# EasyEDA Pro project card-issuance.eprj, schematic Schematic1
Board Name: Power; Create Date: 2026-02-10; Page Name: P1; Project Name: card-issuance; Schematic Name: Schematic1; Update Date: 2026-02-17; Company: EasyEDA.com; Page Size: A4; Version: V1.0
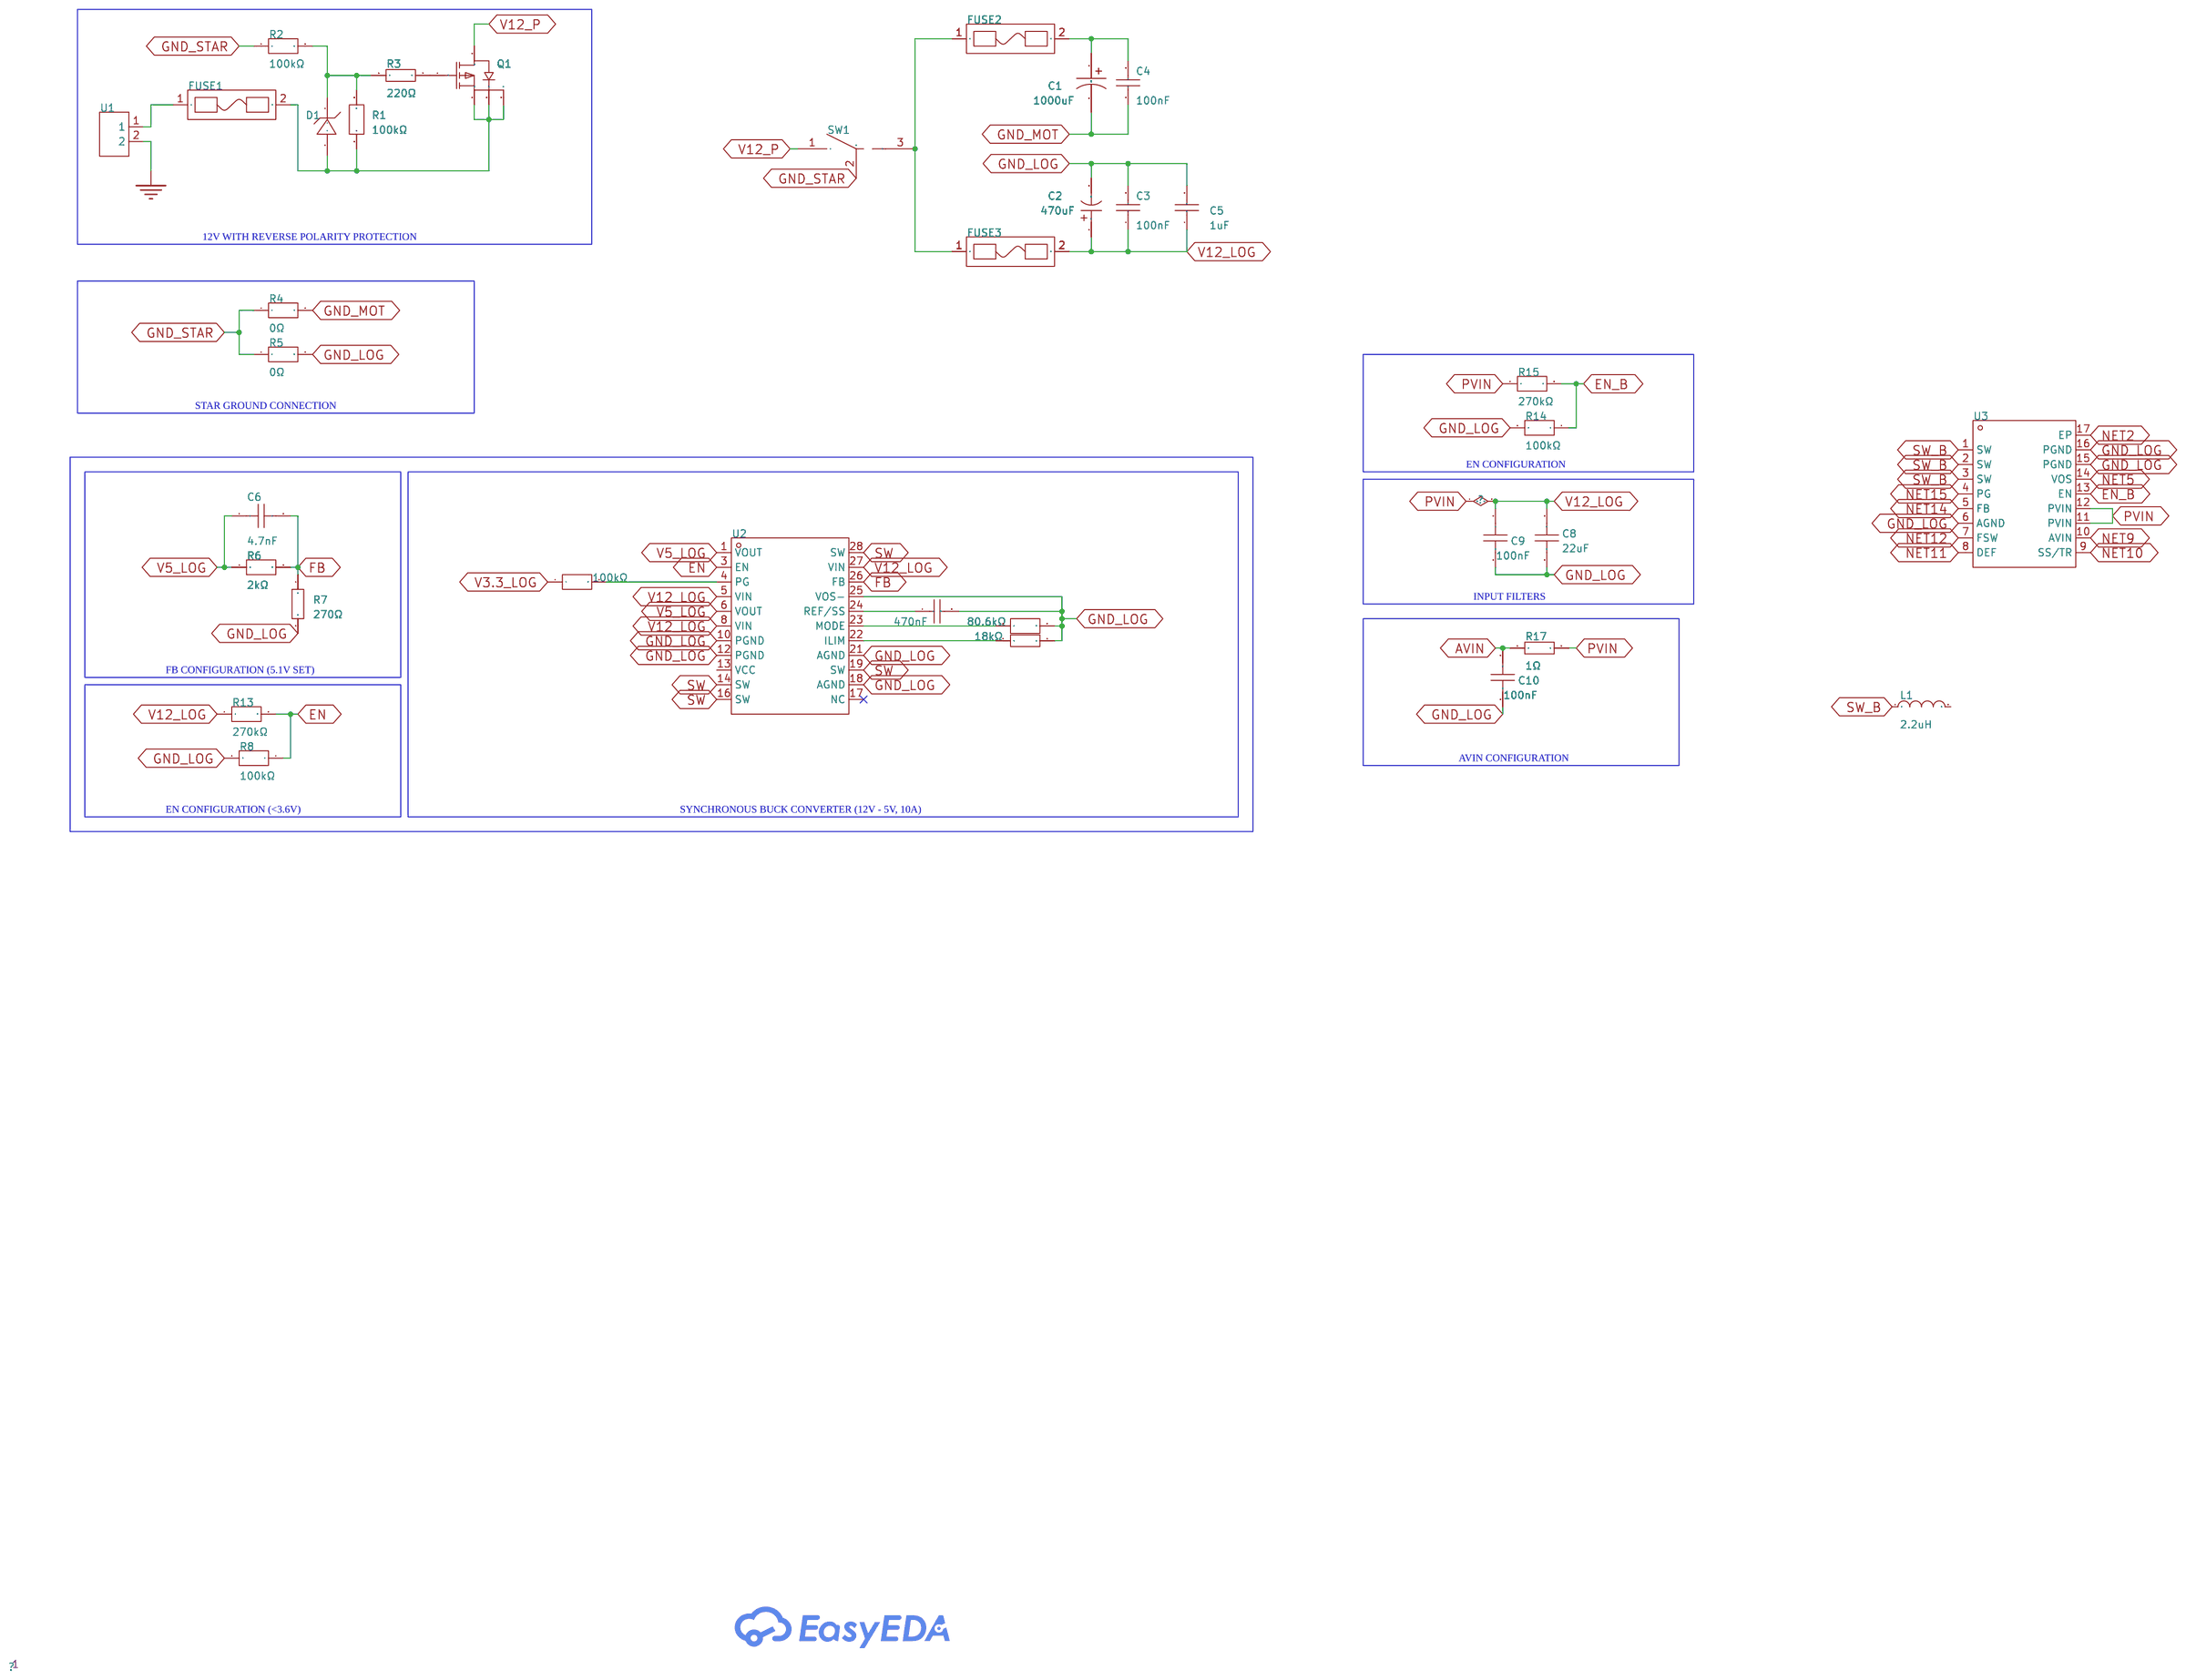
[diagram p0: schematic sheet]

## Parts
C1  1000uF  [CAP-TH_BD10.0-P5.00-D1.0-FD]
C2  470uF  [CAP-TH_BD8.0-P3.50-D0.6-FD]
C3  100nF  [C0402]
C4  100nF  [C0402]
C5  1uF  [C0603]
C6  4.7nF  [CAP-TH_L9.0-W3.5-P7.50-D0.6]
C7  470nF  [C0603]
C8  22uF  [C0805]
C9  100nF  [C0805]
C10  100nF  [C0805]
D1  SMAZ15-13-F  [SMA_L4.3-W2.6-LS5.2-RD]
FUSE1  XF-508P-A-B  [FUSE-TH_XF-508P-A-B]
FUSE2  XF-508P-A-B  [FUSE-TH_XF-508P-A-B]
FUSE3  XF-508P-A-B  [FUSE-TH_XF-508P-A-B]
L1  2.2uH  [IND-SMD_L4.0-W4.0_0.47UH04209.5A]
Q1  HD504P190S  [TDSON-8_L5.9-W5.2-P1.27-BL]
R1  100kΩ  [RES-TH_BD4.5-L11.5-P15.50-D0.8]
R2  100kΩ  [RES-TH_BD4.5-L11.5-P15.50-D0.8]
R3  220Ω  [RES-TH_BD3.3-L9.0-P13.00-D0.6]
R4  0Ω  [RES-TH_BD2.5-L6.5-P10.50-D0.6]
R5  0Ω  [RES-TH_BD2.5-L6.5-P10.50-D0.6]
R6  2kΩ  [RES-TH_BD2.3-L6.5-P10.50-D0.5]
R7  270Ω  [RES-TH_BD2.2-L6.5-P10.50-D0.6]
R8  100kΩ  [RES-TH_BD4.5-L11.5-P15.50-D0.8]
R10  100kΩ  [RES-TH_BD4.5-L11.5-P15.50-D0.8]
R11  18kΩ  [RES-TH_BD2.3-L6.5-P10.50-D0.5]
R12  80.6kΩ  [RES-TH_BD2.5-L6.5-P10.50-D0.6]
R13  270kΩ  [RES-TH_BD2.2-L6.5-P10.50-D0.6]
R14  100kΩ  [RES-TH_BD4.5-L11.5-P15.50-D0.8]
R15  270kΩ  [RES-TH_BD2.2-L6.5-P10.50-D0.6]
R17  1Ω  [RES-TH_BD2.2-L6.5-P10.50-D0.6]
SW1  SS31-BBOWQ-RS20-R  [SW-TH_SS31-BBNNQ-RS30-R]
U1  DB135-10.16-2P-GN-P  [CONN-TH_DG135T-10.16-02P-14-00A]
U2  M1210DQEE  [QFN-28_L7.0-W7.0_M1210DQEE]
U3  TPS62133RGTR  [VQFN-16_L3.0-W3.0-P0.50-TL-EP]

## Library data of the parts
C1 = 01EC4294SHC1000UF25V: LCSC Part Name: 1000uF ±20% 25V; Supplier Part: C503217; Manufacturer: KNSCHA(科尼盛); Supplier Footprint: 插件,D10xL16mm; JLCPCB Part Class: Extended Part; Datasheet: https://item.szlcsc.com/datasheet/01EC4294SHC1000UF25V/515630.html; Supplier: LCSC; Tolerance: ±20%; Voltage Rating: 25V; Ripple Current: 610mA@120Hz; Pin Spacing: 5mm; Diameter: 10mm; Height - Seated (Max): 16mm; Lifetime: 3000hrs@105℃; Operating Temperature: -40℃~+105℃
C2 = KM1E471M0812: LCSC Part Name: 470uF ±20% 25V; Supplier Part: C2873977; Manufacturer: ROQANG(容强); Supplier Footprint: 插件,D8xL12mm; JLCPCB Part Class: Extended Part; Datasheet: https://item.szlcsc.com/datasheet/KM1E471M0812/3078460.html; Supplier: LCSC; Tolerance: ±20%; Voltage Rating: 25V; Ripple Current: 305mA@120kHz; Pin Spacing: 3.5mm; Diameter: 8mm; Height - Seated (Max): 12mm; Lifetime: 2000hrs@105℃; Operating Temperature: -40℃~+105℃
C3 C4 = CL05A104KA5NNNC: LCSC Part Name: 100nF ±10% 25V; Supplier Part: C100072; Manufacturer: SAMSUNG(三星); Supplier Footprint: 0402; JLCPCB Part Class: Extended Part; Datasheet: https://item.szlcsc.com/datasheet/CL05A104KA5NNNC/101286.html; Supplier: LCSC; Tolerance: ±10%; Voltage Rating: 25V; Temperature Coefficient: X5R
C5 = CL10B105KA8NNNC: LCSC Part Name: 1uF ±10% 25V; Supplier Part: C29936; Manufacturer: SAMSUNG(三星); Supplier Footprint: 0603; JLCPCB Part Class: Extended Part; Datasheet: https://item.szlcsc.com/datasheet/CL10B105KA8NNNC/30690.html; Supplier: LCSC; Tolerance: ±10%; Voltage Rating: 25V; Temperature Coefficient: X7R
C6 = 70Y20131: LCSC Part Name: 4.7nF ±20% 300V 等级:Y2; Supplier Part: C5355129; Manufacturer: KNSCHA(科尼盛); Supplier Footprint: 插件,P=7.5mm; JLCPCB Part Class: Extended Part; Datasheet: https://item.szlcsc.com/datasheet/70Y20131/6154586.html; Supplier: LCSC; Tolerance: ±20%; Voltage(AC): 300V; Ratings: Y2; Operating Temperature: -25℃~+125℃
C7 = CL10B474KA8NNNC: LCSC Part Name: 470nF ±10% 25V; Supplier Part: C1623; Manufacturer: SAMSUNG(三星); Supplier Footprint: 0603; JLCPCB Part Class: Basic Part; Datasheet: https://item.szlcsc.com/datasheet/CL10B474KA8NNNC/1975.html; Supplier: LCSC; Tolerance: ±10%; Voltage Rating: 25V; Temperature Coefficient: X7R
C8 = CL21A226MAYNNNE: LCSC Part Name: 22uF ±20% 25V; Supplier Part: C602037; Manufacturer: SAMSUNG(三星); Supplier Footprint: 0805; JLCPCB Part Class: Extended Part; Datasheet: https://item.szlcsc.com/datasheet/CL21A226MAYNNNE/631473.html; Supplier: LCSC; Tolerance: ±20%; Voltage Rating: 25V; Temperature Coefficient: X5R
C9 C10 = CC0805KRX7R9BB104: LCSC Part Name: 100nF ±10% 50V; Supplier Part: C49678; Manufacturer: YAGEO(国巨); Supplier Footprint: 0805; JLCPCB Part Class: Basic Part; Datasheet: https://item.szlcsc.com/datasheet/CC0805KRX7R9BB104/50686.html; Supplier: LCSC; Tolerance: ±10%; Voltage Rating: 50V; Temperature Coefficient: X7R
D1 = SMAZ15-13-F: LCSC Part Name: 独立式 耐压:15V 电流:1uA@11.4V; Supplier Part: C110524; Manufacturer: DIODES(美台); Supplier Footprint: SMA; JLCPCB Part Class: Extended Part; Datasheet: https://item.szlcsc.com/datasheet/SMAZ15-13-F/111747.html; Supplier: LCSC; Diode Configuration: Independent; Zener Voltage(Nom): 15V; Reverse Leakage Current (Ir): 1uA@11.4V; Zener Voltage(Range): 14.25V~15.75V; Pd - Power Dissipation: 1W; Impedance(Zzt): 10Ω; Impedance(Zzk): 150Ω; Operating Junction Temperature Range: -65℃~+150℃
FUSE1-FUSE3 = XF-508P-A-B: LCSC Part Name: 汽车保险丝座三合一 中号; Supplier Part: C19727304; Manufacturer: XFCN(兴飞); Supplier Footprint: DIP-4; JLCPCB Part Class: Extended Part; Datasheet: https://item.szlcsc.com/datasheet/XF-508P-A-B/21052954.html; Supplier: LCSC; Fuseholder Type: Clip; Number of Circuits: 1; Voltage Rating: 500V; Current Rating: 15A; Fuse Type: Blade
L1 = CMLO0420H2R2MTT: LCSC Part Name: 2.2uH ±20%; Supplier Part: C438930; Manufacturer: Cybermax(思博科技); Supplier Footprint: SMD,4x4mm; JLCPCB Part Class: Extended Part; Datasheet: https://item.szlcsc.com/datasheet/CMLO0420H2R2MTT/437754.html; Supplier: LCSC; Tolerance: ±20%; Current Rating: 3A; Type: Magnetic Shielded Inductor
